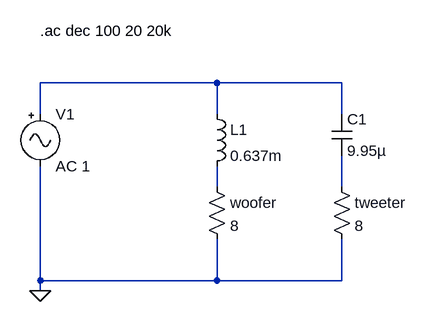
[diagram p0: schematic LC_speaker_crossover.asc]
LC_speaker_crossover.asc, the LTspice schematic file:
Version 4.1
SHEET 1 880 680
WIRE 352 112 80 112
WIRE 544 112 352 112
WIRE 80 160 80 112
WIRE 352 160 352 112
WIRE 544 160 544 112
WIRE 352 272 352 240
WIRE 544 272 544 224
WIRE 80 416 80 240
WIRE 352 416 352 352
WIRE 352 416 80 416
WIRE 544 416 544 352
WIRE 544 416 352 416
WIRE 80 432 80 416
FLAG 80 432 0
SYMBOL Misc\\signal 80 144 R0
SYMATTR InstName V1
SYMATTR Value AC 1
SYMBOL cap 528 160 R0
SYMATTR InstName C1
SYMATTR Value 9.95µ
SYMBOL ind 336 144 R0
SYMATTR InstName L1
SYMATTR Value 0.637m
SYMATTR SpiceLine Rser=0
SYMBOL res 336 256 R0
SYMATTR InstName woofer
SYMATTR Value 8
SYMBOL res 528 256 R0
SYMATTR InstName tweeter
SYMATTR Value 8
TEXT 80 32 Left 2 !.ac dec 100 20 20k

The netlist it stands for:
* LC_speaker_crossover.asc
V1 N001 0 AC 1
C1 N001 N003 9.95µ
L1 N001 N002 0.637m Rser=0
R§woofer N002 0 8
R§tweeter N003 0 8
.ac dec 100 20 20k
.backanno
.end